# EAGLE design eZ430-PaLFI-V1.1 (EAGLE 5.02)
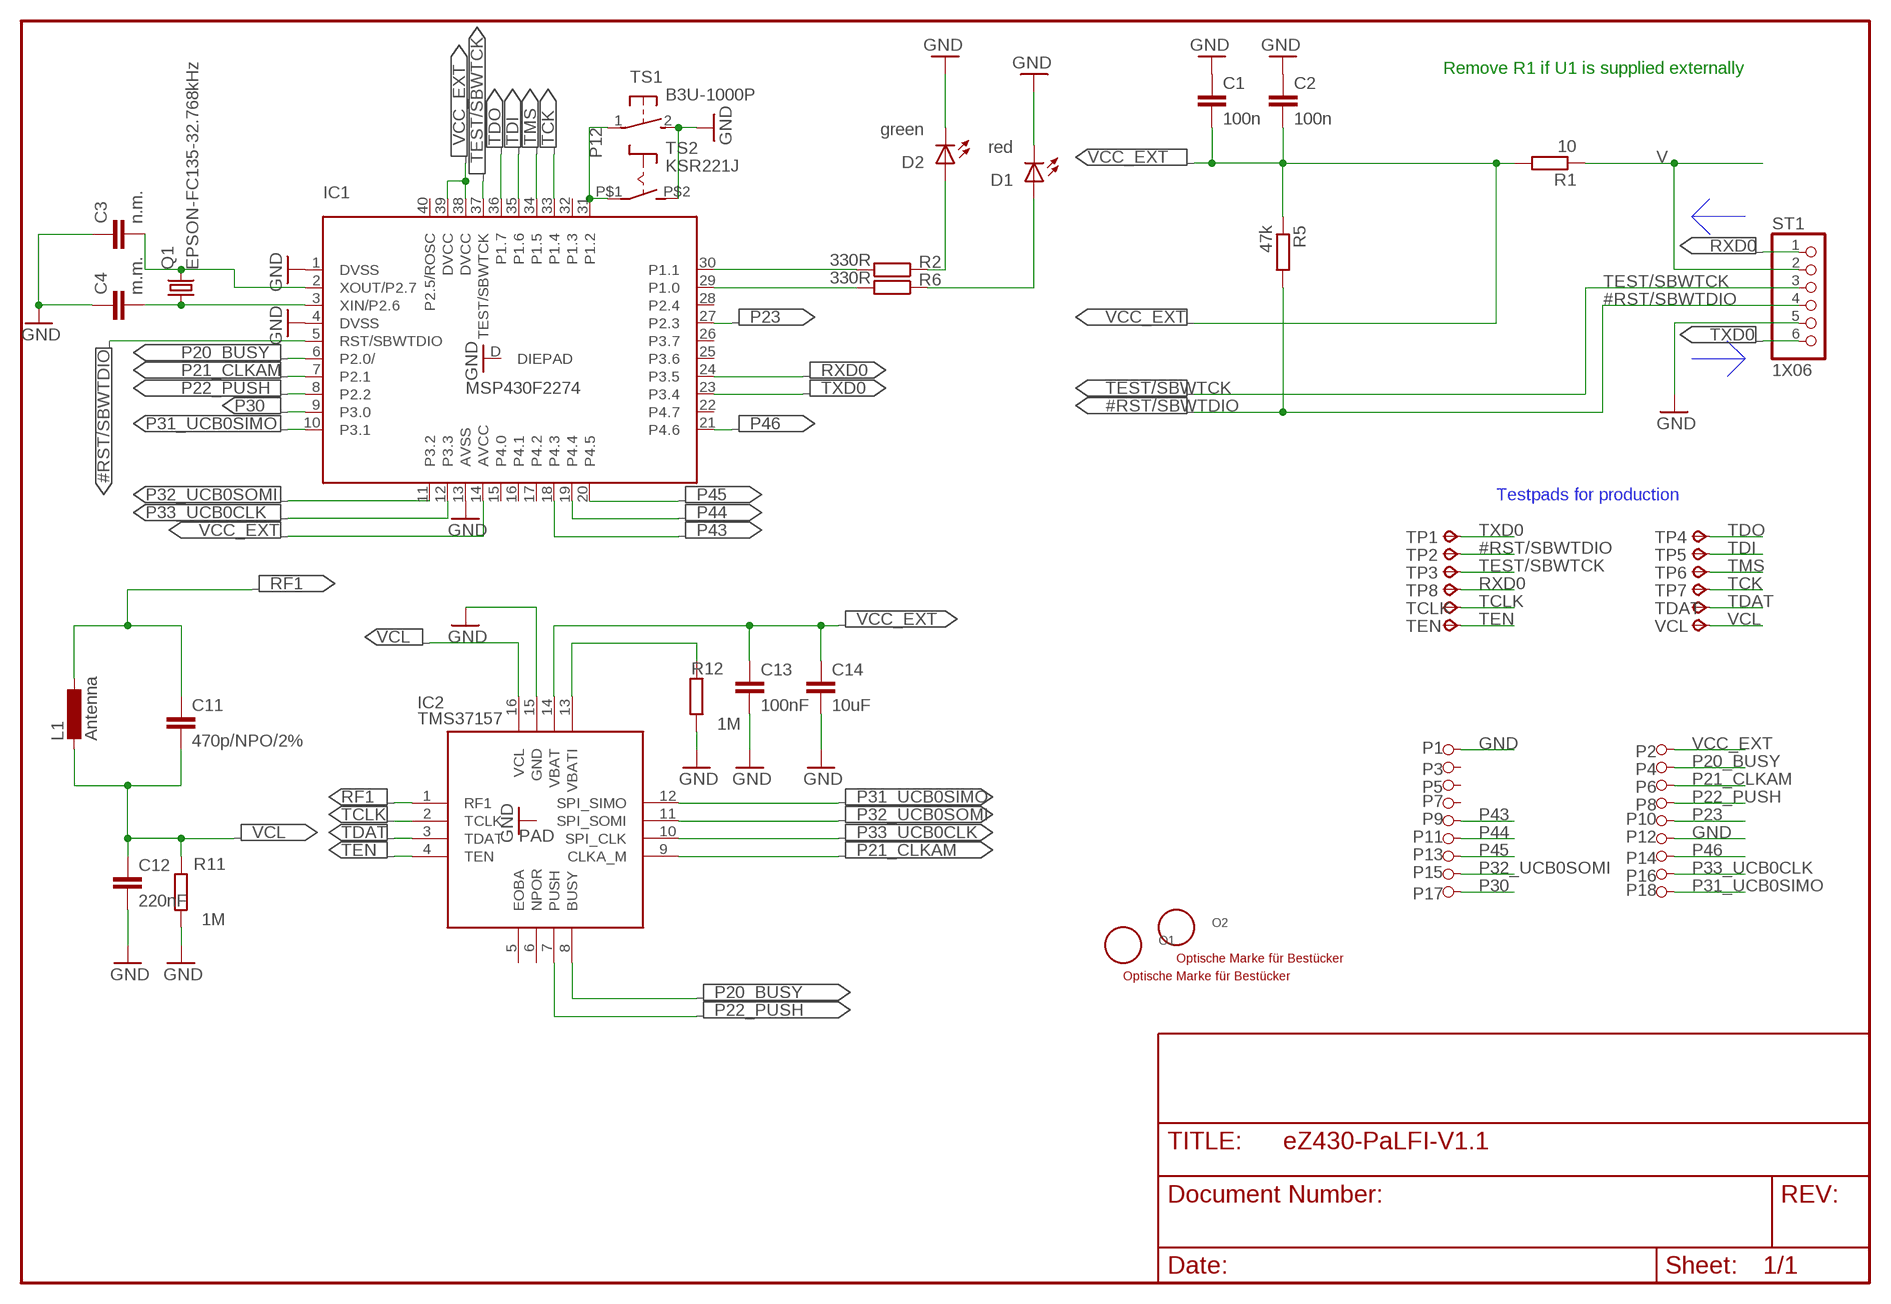
[diagram p0: schematic, sheet 1]

## Parts
C1  100n  C-EUC0402_GE  [C0402_GE]
C2  100n  C-EUC0402_GE  [C0402_GE]
C3  n.m.  C-EUC0402_GE  [C0402_GE]
C4  m.m.  C-EUC0402_GE  [C0402_GE]
C11  470p/NPO/2%  C-EUC0603  [C0603]
C12  220nF  C-EUC0603  [C0603]
C13  100nF  C-EUC0402_GE  [C0402_GE]
C14  10uF  C-EUC0805  [C0805]
D1  red  LEDCHIP-LED0603  [CHIP-LED0603]
D2  green  LEDCHIP-LED0603  [CHIP-LED0603]
IC1  MSP430F2274  [TEXAS_S-PQFP-N40_NVIAS]
IC2  TMS37157  [QFN(RSA)16]
L1  Antenna  TRP-COIL-TDK  [TPL1183525]
O1  OPT_MARKE  [OPTISCHE_MARKE]
O2  OPT_MARKE  [OPTISCHE_MARKE]
P1  TP05TP10  [TP10]
P2  TP05TP10  [TP10]
P3  TP05TP10  [TP10]
P4  TP05TP10  [TP10]
P5  TP05TP10  [TP10]
P6  TP05TP10  [TP10]
P7  TP05TP10  [TP10]
P8  TP05TP10  [TP10]
P9  TP05TP10  [TP10]
P10  TP05TP10  [TP10]
P11  TP05TP10  [TP10]
P12  TP05TP10  [TP10]
P13  TP05TP10  [TP10]
P14  TP05TP10  [TP10]
P15  TP05TP10  [TP10]
P16  TP05TP10  [TP10]
P17  TP05TP10  [TP10]
P18  TP05TP10  [TP10]
Q1  EPSON-FC135-32.768kHz  FC-135EPSON-FC135  [FC135]
R1  10  R-EU_R0402_GE  [R0402_GE]
R2  330R  R-EU_R0402_GE  [R0402_GE]
R5  47k  R-EU_R0402_GE  [R0402_GE]
R6  330R  R-EU_R0402_GE  [R0402_GE]
R11  1M  R-EU_R0402_GE  [R0402_GE]
R12  1M  R-EU_R0402_GE  [R0402_GE]
ST1  1X06  [1X06]
TCLK  TP10R  [TP10R]
TDAT  TP10R  [TP10R]
TEN  TP10R  [TP10R]
TP1  TP10R  [TP10R]
TP2  TP10R  [TP10R]
TP3  TP10R  [TP10R]
TP4  TP10R  [TP10R]
TP5  TP10R  [TP10R]
TP6  TP10R  [TP10R]
TP7  TP10R  [TP10R]
TP8  TP10R  [TP10R]
TS1  B3U-1000P  [B3U-1000P]
TS2  KSR221J  [KSR_ITT]
VCL  TP10R  [TP10R]

## Nets
#RST/SBWTDIO: IC1.5(RST/SBWTDIO) R5.P$2 ST1.4 TP2.TP
GDO2: C3.P$2 IC1.2(XOUT/P2.7) Q1.2
GND [Ground]: C1.P$1 C2.P$1 C3.P$1 C4.P$1 C12.2 C13.P$2 C14.2 D1.C D2.C IC1.1(DVSS) IC1.4(DVSS) IC1.13(AVSS) IC1.D(DIEPAD) IC2.15(GND) IC2.PAD P1.1 P12.1 R11.P$2 R12.P$2 ST1.5 TS1.2(S) TS2.P$2(S)
N$2: D1.A R6.P$1
N$3: IC2.13(VBATI) R12.P$1
N$4: C4.P$2 IC1.3(XIN/P2.6) Q1.1
N$13: IC1.29(P1.0) R6.P$2
N$15: D2.A R2.P$1
N$17: IC1.30(P1.1) R2.P$2
P12: IC1.31(P1.2) TS1.1(P) TS2.P$1(P)
P20_BUSY: IC1.6(P2.0/) IC2.8(BUSY) P4.1
P21_CLKAM: IC1.7(P2.1) IC2.9(CLKA_M) P6.1
P22_PUSH: IC1.8(P2.2) IC2.7(PUSH) P8.1
P23: IC1.27(P2.3) P10.1
P30: IC1.9(P3.0) P17.1
P31_UCB0SIMO: IC1.10(P3.1) IC2.12(SPI_SIMO) P18.1
P32_UCB0SOMI: IC1.11(P3.2) IC2.11(SPI_SOMI) P15.1
P33_UCB0CLK: IC1.12(P3.3) IC2.10(SPI_CLK) P16.1
P43: IC1.18(P4.3) P9.1
P44: IC1.19(P4.4) P11.1
P45: IC1.20(P4.5) P13.1
P46: IC1.21(P4.6) P14.1
RF1: C11.1 IC2.1(RF1) L1.P$1
RXD0: IC1.24(P3.5) ST1.1 TP8.TP
TCK: IC1.33(P1.4) TP7.TP
TCLK [Ground]: IC2.2(TCLK) TCLK.TP
TDAT: IC2.3(TDAT) TDAT.TP
TDI: IC1.35(P1.6) TP5.TP
TDO: IC1.36(P1.7) TP4.TP
TEN [Ground]: IC2.4(TEN) TEN.TP
TEST/SBWTCK: IC1.37(TEST/SBWTCK) ST1.3 TP3.TP
TMS: IC1.34(P1.5) TP6.TP
TXD0: IC1.23(P3.4) ST1.6 TP1.TP
V: R1.P$1 ST1.2
VCC_EXT: C1.P$2 C2.P$2 C13.P$1 C14.1 IC1.14(AVCC) IC1.38(DVCC) IC1.39(DVCC) IC2.14(VBAT) P2.1 R1.P$2 R5.P$1
VCL: C11.2 C12.1 IC2.16(VCL) L1.P$2 R11.P$1 VCL.TP
Unconnected: IC1.15(P4.0) IC1.16(P4.1) IC1.17(P4.2) IC1.22(P4.7) IC1.25(P3.6) IC1.26(P3.7) IC1.28(P2.4) IC1.32(P1.3) IC1.40(P2.5/ROSC) IC2.5(EOBA) IC2.6(NPOR) P3.1 P5.1 P7.1

## Notes on the sheet
- Remove R1 if U1 is supplied externally
- Testpads for production

## Library data of the parts
C1-C4 C11-C14 = rcl:C-EU: CAPACITOR, European symbol
D1 D2 = led:LED: LED OSRAM: - CHIPLED LG R971, LG N971, LY N971, LG Q971, LY Q971, LO R971, LY R971 LH N974, LH R974 LS Q976, LO Q976, LY Q976 LO Q996 - Hyper CHIPLED LW Q18S LB Q993, LB Q99A, LB R99A - SideLED LS A670, LO A670, LY A670, LG A670, LP A670 LB A673, LV A673, LT A673, LW A673 LH A674 LY A675 LS A676, LA A676, LO A676, LY A676, LW A676 LS A679, LY A679, LG A679 - Hyper Micro SIDELED® LS Y876, LA Y876, LO Y876, LY Y876 LT Y87S - SmartLED LW L88C, LW L88S LB L89C, LB L89S, LG L890 LS L89K, LO L89K, LY L89K LS L896, LA L896, LO L896, LY L896 - TOPLED LS T670, LO T670, LY T670, LG T670, LP T670 LSG T670, LSP T670, LSY T670, LOP T670, LYG T670 LG T671, LOG T671, LSG T671 LB T673, LV T673, LT T673, LW T673 LH T674 LS T676, LA T676, LO T676, LY T676, LB T676, LH T676, LSB T676, LW T676 LB T67C, LV T67C, LT T67C, LS T67K, LO T67K, LY T67K, LW E67C LS E67B, LA E67B, LO E67B, LY E67B, LB E67C, LV E67C, LT E67C LW T67C LS T679, LY T679, LG T679 LS T770, LO T770, LY T770, LG T770, LP T770 LB T773, LV T773, LT T773, LW T773 LH T774 LS E675, LA E675, LY E675, LS T675 LS T776, LA T776, LO T776, LY T776, LB T776 LHGB T686 LT T68C, LB T68C - Hyper Mini TOPLED® LB M676 - Mini TOPLED Santana® LG M470 LS M47K, LO M47K, LY M47K Source: http://www.osram.convergy.de/
IC1 = texas:MSP430F2274
IC2 = RFID_Automotive:TMS37157
L1 = RFID_Automotive:TRP-COIL-TDK: Transponder Coil TDK TPL1183525 2.61mH
O1 O2 = testpad:OPT_MARKE
P1-P18 = usbfet:TP05
Q1 = RFID_Automotive:FC-135
R1 R2 R5 R6 R11 R12 = rcl:R-EU_: RESISTOR, European symbol
ST1 = pinhead_1.27mm:1X06
TCLK TDAT TEN TP1-TP8 VCL = testpad:TP10R: TEST PIN
TS1 = switch-omron:B3U-1000P
TS2 = switch:KSR221J

## Net classes
0 default: width 0.1 mm, drill 0.2 mm
1 Ground: width 0.1 mm, drill 0.2 mm

## Board
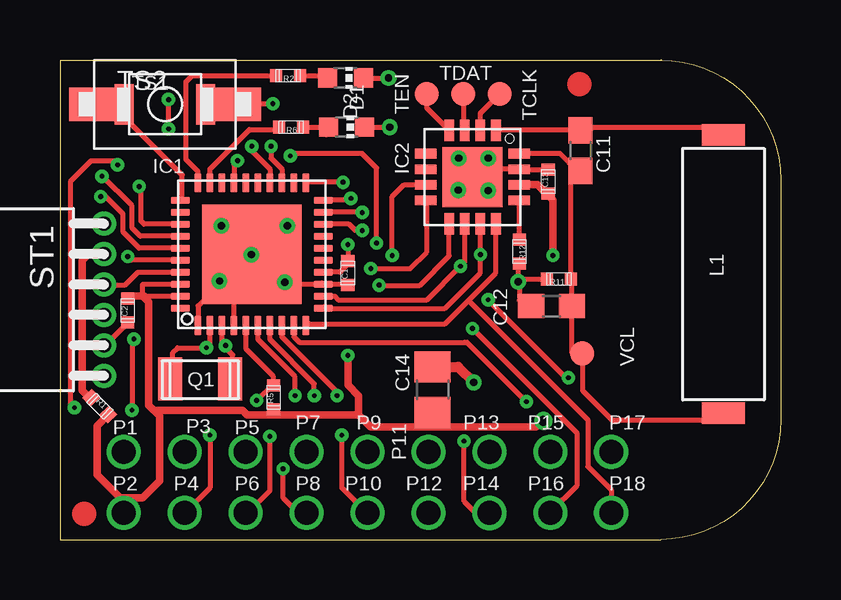
[diagram p1: board, top side]
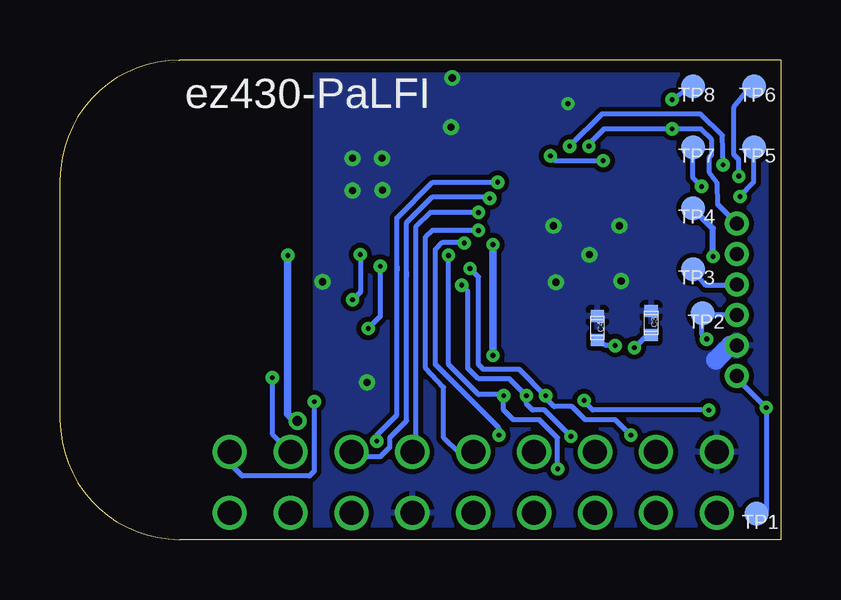
[diagram p2: board, bottom side, seen from below]

Size 30.05 x 20 mm. Coordinates in mm from the lower left corner, seen from the top.
Outline: 25.05,20 0,20 0,0 25.05,0 arc90 30.05,5 30.05,15 arc90 25.05,20
Outline: 25.1,20 25.05,20
Copper layers (1+2*15+16): Top 0.018mm / dielectric 0.38mm / Route2 0.035mm / dielectric 0.71mm / Route15 0.035mm / dielectric 0.38mm / Bottom 0.018mm
Design rules "PCB-POOL *": minimum track width 6mil, minimum drill 0.2mm, track to track 6mil, track to pad 6mil, pad to pad 6mil, via to via 6mil, smd to smd 0mil, copper to edge 20mil, drill to drill 8mil, minimum pad ring 8mil, minimum via ring 7mil, stop-mask expansion 3mil, vias tented up to drill 0mil, thermal gap 8mil

### Footprints (pad centres in the part's own frame; a part is rotated, then mirrored left to right if it is on the bottom)
C0402_GE = smd 0.5 x 0.55: P$1 -0.5,0; P$2 0.5,0
C0603 = smd 1.1 x 1: 1 -0.85,0; 2 0.85,0
C0805 = smd 1.3 x 1.5: 1 -0.95,0; 2 0.95,0
CHIP-LED0603 = smd 0.8 x 0.8: A 0,-0.75; C 0,0.75
TEXAS_S-PQFP-N40_NVIAS = smd 0.8 x 0.3: 1 -2.975,2.25; 2 -2.975,1.75; 3 -2.975,1.25; 4 -2.975,0.75; 5 -2.975,0.25; 6 -2.975,-0.25; 7 -2.975,-0.75; 8 -2.975,-1.25; 9 -2.975,-1.75; 10 -2.975,-2.25; 21 2.975,-2.25; 22 2.975,-1.75; 23 2.975,-1.25; 24 2.975,-0.75; 25 2.975,-0.25; 26 2.975,0.25; 27 2.975,0.75; 28 2.975,1.25; 29 2.975,1.75; 30 2.975,2.25 | smd 0.3 x 0.8: 11 -2.25,-2.975; 12 -1.75,-2.975; 13 -1.25,-2.975; 14 -0.75,-2.975; 15 -0.25,-2.975; 16 0.25,-2.975; 17 0.75,-2.975; 18 1.25,-2.975; 19 1.75,-2.975; 20 2.25,-2.975; 31 2.25,2.975; 32 1.75,2.975; 33 1.25,2.975; 34 0.75,2.975; 35 0.25,2.975; 36 -0.25,2.975; 37 -0.75,2.975; 38 -1.25,2.975; 39 -1.75,2.975; 40 -2.25,2.975 | smd 4.15 x 4.15: D 0,0
QFN(RSA)16 = smd 0.9 x 0.4: 1 -1.95,0.975; 2 -1.95,0.325; 3 -1.95,-0.325; 4 -1.95,-0.975; 9 1.95,-0.975; 10 1.95,-0.325; 11 1.95,0.325; 12 1.95,0.975 | smd 0.4 x 0.9: 5 -0.975,-1.95; 6 -0.325,-1.95; 7 0.325,-1.95; 8 0.975,-1.95; 13 0.975,1.95; 14 0.325,1.95; 15 -0.325,1.95; 16 -0.975,1.95 | smd 2.5 x 2.5: PAD 0,0
TPL1183525 = smd 0.9 x 1.8: P$1 -0.85,0; P$2 10.75,0
TP10 = drill 1 pad 1.422 round: 1 0,0
FC135 = smd 1 x 1.8: 1 -1.25,0; 2 1.25,0
R0402_GE = smd 0.5 x 0.55: P$1 -0.5,0; P$2 0.5,0
1X06 = drill 0.6 round: 1 -3.175,0; 2 -1.905,0; 3 -0.635,0; 4 0.635,0; 5 1.905,0; 6 3.175,0
TP10R = smd 1 x 1: TP 0,0
B3U-1000P = smd 0.8 x 1.7: 1 -1.7,0; 2 1.7,0
KSR_ITT = smd 2 x 1.4: P$1 -3,0; P$2 3,0

### Placement (x,y rotation side)
C1  12,11.11 90 top
C2  2.83,9.55 90 top
C3  5.4,9.03 270 bottom
C4  7.64,8.83 270 bottom
C11  21.7,16.22 270 top
C12  20.5,9.73 180 top
C13  20.36,14.93 90 top
C14  15.54,6.25 90 top
D1  11.95,17.2 270 top
D2  11.9,19.25 270 top
IC1  8,11.9 90 top
IC2  17.2,15.12 270 top
L1  27.66,16.02 270 top
O1  21.65,19 0 top
O2  1,1.07 0 top
P1  2.66,3.65 90 top
P2  2.66,1.11 180 top
P3  5.2,3.65 270 top
P4  5.2,1.11 270 top
P5  7.74,3.65 270 top
P6  7.74,1.11 270 top
P7  10.28,3.65 90 top
P8  10.28,1.11 270 top
P9  12.82,3.65 90 top
P10  12.82,1.11 90 top
P11  15.36,3.65 0 top
P12  15.36,1.11 90 top
P13  17.9,3.65 0 top
P14  17.9,1.11 0 top
P15  20.44,3.65 0 top
P16  20.44,1.11 270 top
P17  22.98,3.65 0 top
P18  22.98,1.11 90 top
Q1  5.85,6.7 180 top
R1  1.66,5.56 315 top
R2  9.5,19.35 180 top
R5  8.9,5.92 90 top
R6  9.62,17.2 180 top
R11  20.8,10.87 180 top
R12  19.15,12.02 270 top
ST1  1.83,10 270 top
TCLK  18.34,18.58 90 top
TDAT  16.82,18.58 90 top
TEN  15.3,18.58 90 top
TP1  1,1.08 90 bottom
TP2  3.26,9.43 90 bottom
TP3  3.66,11.27 90 bottom
TP4  3.66,13.81 90 bottom
TP5  1.12,16.35 90 bottom
TP6  1.12,18.89 90 bottom
TP7  3.66,16.35 90 bottom
TP8  3.66,18.89 0 bottom
TS1  4.38,18.15 0 top
TS2  4.38,18.15 0 top
VCL  21.78,7.76 0 top

### Tracks (layer width: path | path; a pad name or v marks a point on that pad's centre or on a via)
#RST/SBWTDIO  (via drill 0.2)
  Top 0.2: 7.8,8.8 7.75,8.85 IC1.5 | IC1.5 7.74,8.93 | IC1.5 | IC1.5 7.78,8.89 | R5.P$2 8.9,6.4 | R5.P$2 | 8.9,6.5 R5.P$2 | 8.9,6.5 8.9,6.8 7.75,7.95 IC1.5 | 8.9,6.5 | 8.9,6.5 R5.P$2 | v8.2,5.8 8.9,6.5 | v3.08,8.36 3.08,8.31 3.1,8.3 3,8.2 v3,5.4 | IC1.5 7.75,9.05
  Bottom 0.2: 3.3,9.4 TP2.TP | ST1.4 3.27,9.37 3.3,9.4 | 3.3,9.4 3.3,8.57 v3.08,8.36 | v8.2,5.8 8.2,5.75 7.85,5.4 v3,5.4
GDO2  (via drill 0.2)
  Top 0.2: Q1.2 4.7,7.2 4.7,7.8 4.9,8 v6.1,8 | IC1.2 6.2,8.88 6.25,8.82 6.25,8 v6.1,8 | 6.24,8.11 6.21,8.11 v6.1,8
  Bottom 0.2: C3.P$2 5.57,8.53 v6.1,8
GND  (via drill 0.2 pad 0.55, 0.3)
  Top 0.2: D2.C v13.7,19.25 | TS1.2 7.25,18.18 7.28,18.18 | 7.28,18.18 v8.88,18.18 | 7.28,18.18 7.28,18.15 TS2.P$2 | v6.65,10.78 6.65,10.47 | 6.63,10.78 6.62,10.78 | v6.65,10.78 6.63,10.78 | IC1.D 7.75,11.9 6.63,10.78 | v6.65,10.78 6.67,10.78 7.03,10.43 | 7.03,10.43 7.33,10.12 | IC2.PAD 17.14,15.12 v16.6,14.57 | v6.65,10.78 6.65,10.75 6.7,10.7 5.75,9.75 IC1.1 | 7.03,10.43 7.2,10.6 7.25,10.55 IC1.4 | v6.65,10.78 6.67,10.8 9.64,10.8 | 9.8,10.7 9.7,10.8 9.64,10.8 | C1.P$1 11.96,10.65 IC1.13 10.93,10.7 10.88,10.66 9.64,10.66 9.64,10.8 | ST1.5 1.9,8.1 2.83,9.03 C2.P$1 | D1.C v13.75,17.2 | R12.P$2 19.12,11.42 19.1,11.4 v19.1,10.75 | C12.2 19.4,9.98 19.15,9.98 19.15,10.75 v19.1,10.75 | 19.4,15.45 | IC2.15 19.4,15.45 | 19.4,15.45 19.4,15.43 | IC2.15 18.2,15.45 17.8,15.45 17.8,15.9 v17.85,15.9 | IC2.15 | C13.P$2 19.15,15.43 IC2.15 | R11.P$2 19.1,10.87 v19.1,10.75
  Top 0.254: v6.72,13.08 v6.72,13.07 6.7,13.05 9.1,10.65
  Top 0.305: ST1.5 | ST1.5 1.8,8.1 | ST1.5 1.9,8.1
  Top 0.406: C14.2 16.6,7.2 v17.25,6.55
  Bottom 0.813: 1.9,8.1 2.1,8.1 2.7,7.5
  other vias: 7.97,11.88 16.62,15.9 17.85,14.55 9.47,13.08 9.38,10.73
  pour Bottom (isolate 0.2): 19.4,20.02 0,20 0,0 19.4,0
N$2
  Top 0.2: D1.A 11.1,17.1 11.1,16.88 | D1.A 11.25,17.2 | R6.P$1 D1.A
N$3
  Top 0.2: R12.P$1 19.17,12.42 19.18,12.43 19.15,12.45 IC2.13
N$4  (via drill 0.2)
  Top 0.2: IC1.3 6.72,8.93 6.7,8.9 6.75,8.85 | Q1.1 7.2,6.5 7.2,7.7 6.9,8 v6.9,8.09 6.75,8.24 IC1.3 | 6.75,8.85 6.8,8.8 | IC1.3 6.75,8.85
  Bottom 0.2: C4.P$2 7.64,8.36 7.6,8.4 7.3,8.1 v6.9,8.09
N$13
  Top 0.2: IC1.29 6.3,14.9 | R6.P$2 9.25,17.12 9.25,17.1 7.9,17.1 6.25,15.45 IC1.29 | IC1.29 6.25,14.65
N$15
  Top 0.2: D2.A 11.15,19.2 11,19.35 R2.P$1
N$17
  Top 0.2: R2.P$2 5.5,19.35 5.25,19.1 5.25,15.85 5.75,15.35 IC1.30
P12
  Top 0.2: 1.73,17.99 0.75,17.82 0.8,17.77 1.77,17.75 | 1.73,17.99 TS1.1 | 2.8,17.48 1.77,17.75 | 2.8,17.48 2.92,17.45 | 1.77,17.75 1.77,17.95 1.73,17.99 | 1.77,17.75 TS2.P$1 | 2.8,17.48 2.8,17.5 5.1,15.2 5.1,14.2 5.05,14.15 IC1.31
P20_BUSY  (via drill 0.2)
  Top 0.2: 8.24,8.88 8.27,8.91 IC1.6 8.25,8.9 | 15.3,14.1 15.29,14.1 | 15.3,14.1 15.3,12 14.6,11.3 v12.95,11.3 | 8.3,8.7 8.25,8.75 8.25,8.9 | v9.8,6 9.8,6.8 8.25,8.35 8.25,8.9 | IC2.8 15.2,14.2 15.3,14.1 | P4.1 6.25,2.16 v6.25,4.35
  Bottom 0.2: v12.95,11.3 12.9,11.3 | v12.95,11.3 | v12.95,11.3 12.6,10.95 12.6,7.3 12.4,7.1 10.9,7.1 v9.8,6 9.8,5.9 9.45,5.55 8.7,5.55 8.15,5 6.9,5 v6.25,4.35
P21_CLKAM  (via drill 0.2)
  Top 0.2: IC2.9 16.23,11.82 15,10.6 13.4,10.6 13.4,10.61 v13.3,10.61 | IC1.7 | IC1.7 8.8,8.88 | IC1.7 8.75,8.95 | v10.6,6 10.6,6.5 8.75,8.35 IC1.7 | v8.75,4.3 8.75,2.05 7.85,1.15 7.75,1.15 P6.1
  Bottom 0.2: 13.4,10.6 v13.3,10.61 v13.3,10.6 13.05,10.35 13.05,7.13 12.6,6.7 11.3,6.7 v10.6,6 10.6,5.65 10.35,5.4 9.85,5.4 v8.75,4.3
P22_PUSH  (via drill 0.2)
  Top 0.2: IC1.8 9.27,8.9 | IC1.8 9.25,8.95 | 14.9,14.8 14.9,14.79 | IC1.8 9.25,8.45 11.55,6.15 v11.55,6 | 14.9,14.8 14.35,14.8 13.85,14.3 v13.85,11.85 | IC2.7 14.9,14.8 | P8.1 9.95,1.1 9.3,1.75 v9.3,2.95
  Bottom 0.2: v13.85,11.85 13.85,7.3 12.6,6.05 11.55,6.05 v11.55,6 11.55,5.4 11.15,5 10.05,5 9.3,4.25 v9.3,2.95
P23  (via drill 0.2)
  Top 0.2: v9.6,16 9.7,16.1 12.6,16.1 13.2,15.5 v13.2,12.37 | IC1.27 7.25,15.65 v7.4,15.8 | P10.1 12.8,1.1 11.75,2.15 v11.75,4.35
  Bottom 0.2: v7.4,15.8 9.4,15.8 v9.6,16 | v13.2,12.37 13.2,12.4 14.1,12.4 14.4,12.1 14.4,7.3 11.75,4.65 v11.75,4.35
P30  (via drill 0.2)
  Top 0.2: 9.8,8.88 IC1.9 9.75,8.46 9.98,8.22 16.88,8.22 16.98,8.22 v19.45,5.75
  Bottom 0.2: v19.45,5.75 19.45,2.85 19.65,2.65 22.45,2.65 23,3.2 23,3.63 P17.1
P31_UCB0SIMO
  Top 0.2: IC1.10 10.28,8.93 10.3,8.9 10.4,9 16.05,9 17.02,9.97 | P18.1 22.98,2.07 22,3.05 22,5 17.02,9.97 | IC2.12 18.18,11.12 17.02,9.97
P32_UCB0SOMI  (via drill 0.2)
  Top 0.2: IC1.11 10.97,9.68 11,9.7 11.06,9.64 16.04,9.64 17.4,11 | 17.4,11 17.52,11.12 17.52,12.07 | 17.52,12.07 IC2.11 | 17.4,11 | 17.4,11 | 17.4,11 17.5,11.1 | v21.2,6.75 21.1,6.75 v17.85,10 | 17.52,12.07 17.53,12.07 v17.53,11.88
  Bottom 0.2: P15.1 21.2,4.41 v21.2,6.75 | v17.85,10 17.53,10.32 v17.53,11.88
P33_UCB0CLK  (via drill 0.2)
  Top 0.2: 10.85,10.15 IC1.12 11.05,10.15 | IC2.10 16.88,11.57 v16.7,11.4 15.3,10 11.6,10 11.45,10.15 11.05,10.15 | 11.05,10.15 11.1,10.1 | v17.2,8.8 21.55,4.45 21.55,2.25 20.41,1.11 | 20.41,1.11 20.4,1.1 | 20.41,1.11 P16.1
  Bottom 0.2: 16.7,11.1 v16.7,11.4 16.7,9.3 v17.2,8.8
P43  (via drill 0.2)
  Top 0.2: v12.6,12.89 12.7,12.9 12.3,12.9 12.05,13.15 IC1.18
  Bottom 0.2: v12.6,12.89 12.71,12.9 14.53,12.9 14.8,12.63 14.8,7.15 14.05,6.35 14.05,4.25 13.4,3.6 12.85,3.6 12.85,3.62 P9.1
P44  (via drill 0.2)
  Top 0.2: IC1.19 11.03,13.65 11.07,13.68 11.11,13.65 | IC1.19 | v12.6,13.64 12.49,13.65 12.48,13.65 IC1.19
  Bottom 0.2: v12.6,13.64 12.8,13.64 12.7,13.65 14.61,13.65 15.2,13.06 15.2,3.8 15.21,3.8 P11.1
P45  (via drill 0.2)
  Top 0.2: 10.98,14.14 IC1.20 12.03,14.15 12.04,14.14 v12.13,14.23
  Bottom 0.2: v12.13,14.23 12.1,14.2 | v12.13,14.23 | 15.6,11.15 15.6,13.22 14.52,14.3 12.2,14.3 v12.13,14.23 | 15.6,11.15 15.6,11 | P13.1 17.8,3.55 17.8,3.45 16.7,3.45 16.31,3.84 16.31,4.24 15.9,4.65 15.6,4.95 15.6,11.15
P46  (via drill 0.2)
  Top 0.2: IC1.21 10.28,14.9 v11.8,14.9 | P14.1 17.35,1.1 16.85,1.6 v16.85,4.1 v16.84,4.1 v16.84,4.11
  Bottom 0.2: 16,11.4 16,13.41 14.51,14.9 v11.8,14.9 | 16,11.4 16,11.2 | v16.84,4.11 16.84,4.36 16,5.2 16,11.4
RF1
  Top 0.2: C11.1 22.12,17.1 21.65,17.1 | IC2.1 18.2,17.1 21.65,17.1 | C11.1 21.82,16.95 | C11.1 21.7,17.05 | L1.P$1 27.6,16.87 27.6,17.2 21.65,17.2 21.65,17.1 | 21.65,17.1 21.65,17.07 C11.1
RXD0  (via drill 0.2, 0.2 pad 0.55)
  Top 0.2: v4.53,17.12 v4.53,18.35 | v8,16.4 8,16.2 8.75,15.45 IC1.24
  Bottom 0.2: 4.3,17.12 3.33,17.12 2.88,16.68 2.88,16.05 2.98,15.95 2.98,15.3 2.65,14.88 2.62,13.97 ST1.1 | TP8.TP 3.76,18.89 v4.53,18.35 | 4.3,17.12 v4.53,17.12 | v8,16.4 8,16.5 7.38,17.12 4.3,17.12
TCK  (via drill 0.2 pad 0.55)
  Top 0.2: v3.3,14.72 3.38,14.65 3.38,13.28 3.5,13.15 IC1.33
  Bottom 0.2: TP7.TP 3.66,15.09 v3.3,14.72
TCLK
  Top 0.2: TCLK.TP 18.35,18.6 | TCLK.TP | IC2.2 17.52,17.77 TCLK.TP
TDAT
  Top 0.2: TDAT.TP 16.85,18.55 16.85,17.09 IC2.3
TDI  (via drill 0.2 pad 0.55)
  Top 0.2: IC1.35 3.3,12.15 2.62,12.82 2.62,13.57 1.9,14.3 v1.7,14.3
  Bottom 0.2: TP5.TP 1.27,16.34 1.25,16.32 1.12,16.48 1.12,14.9 v1.7,14.3
TDO  (via drill 0.2 pad 0.55)
  Top 0.2: IC1.36 2.98,11.65 v2.83,11.8 v2.82,11.8
  Bottom 0.254: v2.82,11.8 v2.83,11.8 2.83,12.97 TP4.TP
TEN
  Top 0.2: 15.3,18.6 TEN.TP 15.3,18 IC2.4
TEST/SBWTCK
  Top 0.2: IC1.37 3.25,11.15 2.73,10.62 1.82,10.62 ST1.3
  Bottom 0.2: ST1.3 1.8,10.6 3.12,10.6 TP3.TP
TMS  (via drill 0.2 pad 0.55)
  Top 0.2: IC1.34 3.35,12.65 3,13 3,13.93 v1.75,15.15
  Bottom 0.2: v1.75,15.15 1.75,15.85 1.95,16.05 1.95,18.02 1.25,18.9 1.26,18.89 TP6.TP 1.26,18.89 1.25,18.88
TXD0  (via drill 0.2, 0.2 pad 0.55)
  Top 0.2: 2.4,15.6 v2.4,15.62 2.4,15.7 2.3,15.8 1.3,15.8 0.45,14.95 0.45,5.65 v0.6,5.5 0.62,5.53 0.62,5.55 | v8.8,16.4 8.8,15.9 9.25,15.45 IC1.23 | IC1.23 9.3,14.9 | IC1.23 9.25,14.85
  Bottom 0.2: ST1.6 1.8,6.8 1.8,6.7 v0.6,5.5 0.6,1.2 0.88,1.2 TP1.TP | v2.4,15.62 2.42,16.85 3.35,17.75 7.45,17.75 v8.8,16.4
V
  Top 0.305: ST1.2 1.21,11.9 0.94,11.63 0.94,6.21 1.25,5.9 1.26,5.91 R1.P$1
VCC_EXT  (via drill 0.2, 0.4)
  Top 0.2: IC1.39 3.5,10.15 3.45,10.15 3.45,10.65 IC1.38 | 10.99,11.17 IC1.14 11.67,11.15 11.96,11.44 11.96,11.58 11.97,11.58 | 8.9,5.35 R5.P$1 | v12,12.3 C1.P$2 11.95,11.6 11.9,11.6 | 2.8,10.1 2.8,10.05 C2.P$2 | 20.38,14.43 20.23,14.28 | C13.P$1 20.38,14.43 | 20.38,14.43 20.4,14.45
  Top 0.254: 15.5,4.7 15.5,5.3
  Top 0.305: 3.45,10.15 3.05,10.15 2.9,10 2.85,10.05 | 3.5,10.15 3.5,10.1 3.7,9.9 3.7,5.6 | 3.7,5.6 3.92,5.39 7.62,5.39 7.81,5.2 9,5.2 9,5.32 | 13.3,4.7 13.2,4.7 | 13.3,4.7 15.5,4.7 19.85,4.7 v20.15,4.95 | v12,7.68 12,6.45 12.45,6 12.45,5.2 | 8.9,5.35 8.95,5.35 8.9,5.4 R5.P$1 9,5.32 | C1.P$2 11.98,11.58 11.96,11.58 | 2.85,10.05 | 2.85,10.05 C2.P$2 | P2.1 2.62,1.15 2.6,1.15 2.6,1.65 2.52,1.72 | 2.52,1.72 1.55,2.7 1.55,4.75 R1.P$2 | R1.P$2 2.05,5.25 | R1.P$2 | IC2.14 19.91,14.79 20.3,14.4 | 20.3,14.4 20.33,14.43 C13.P$1 | v20.55,11.85 20.55,14.15 20.3,14.4 | 3.7,5.6 4.15,5.15 4.15,2.45 3.45,1.75 2.55,1.75 2.52,1.72 | 9,5.32 9.12,5.2 12.45,5.2 | 12.45,5.2 12.95,4.7 13.3,4.7
  Top 0.406: 15.5,5.3 C14.1
  Bottom 0.305: v12,7.68 v12,12.3 | v20.55,11.85 20.55,5.25 20.15,4.85 20,4.85 v20.15,4.95
VCL
  Top 0.2: C12.1 | C12.1 21.35,9.8 | 21.35,9.8 21.35,10.85 R11.P$1 21.3,15.14 21.6,15.45 21.68,15.37 C11.2 21.58,15.37 20.86,16.09 IC2.16 | 21.4,9.75 21.36,9.75 C12.1 | 21.35,9.8 C12.1 | 21.35,9.8 21.35,7.78 21.8,7.78 VCL.TP 21.78,7.73 21.75,7.7 21.8,7.65 21.8,6.2 23,5 27.4,5 27.4,5.27 L1.P$2

### Text on the board
bNames: ez430-PaLFI